# EAGLE design alimrobotmobile (EAGLE 6.3)
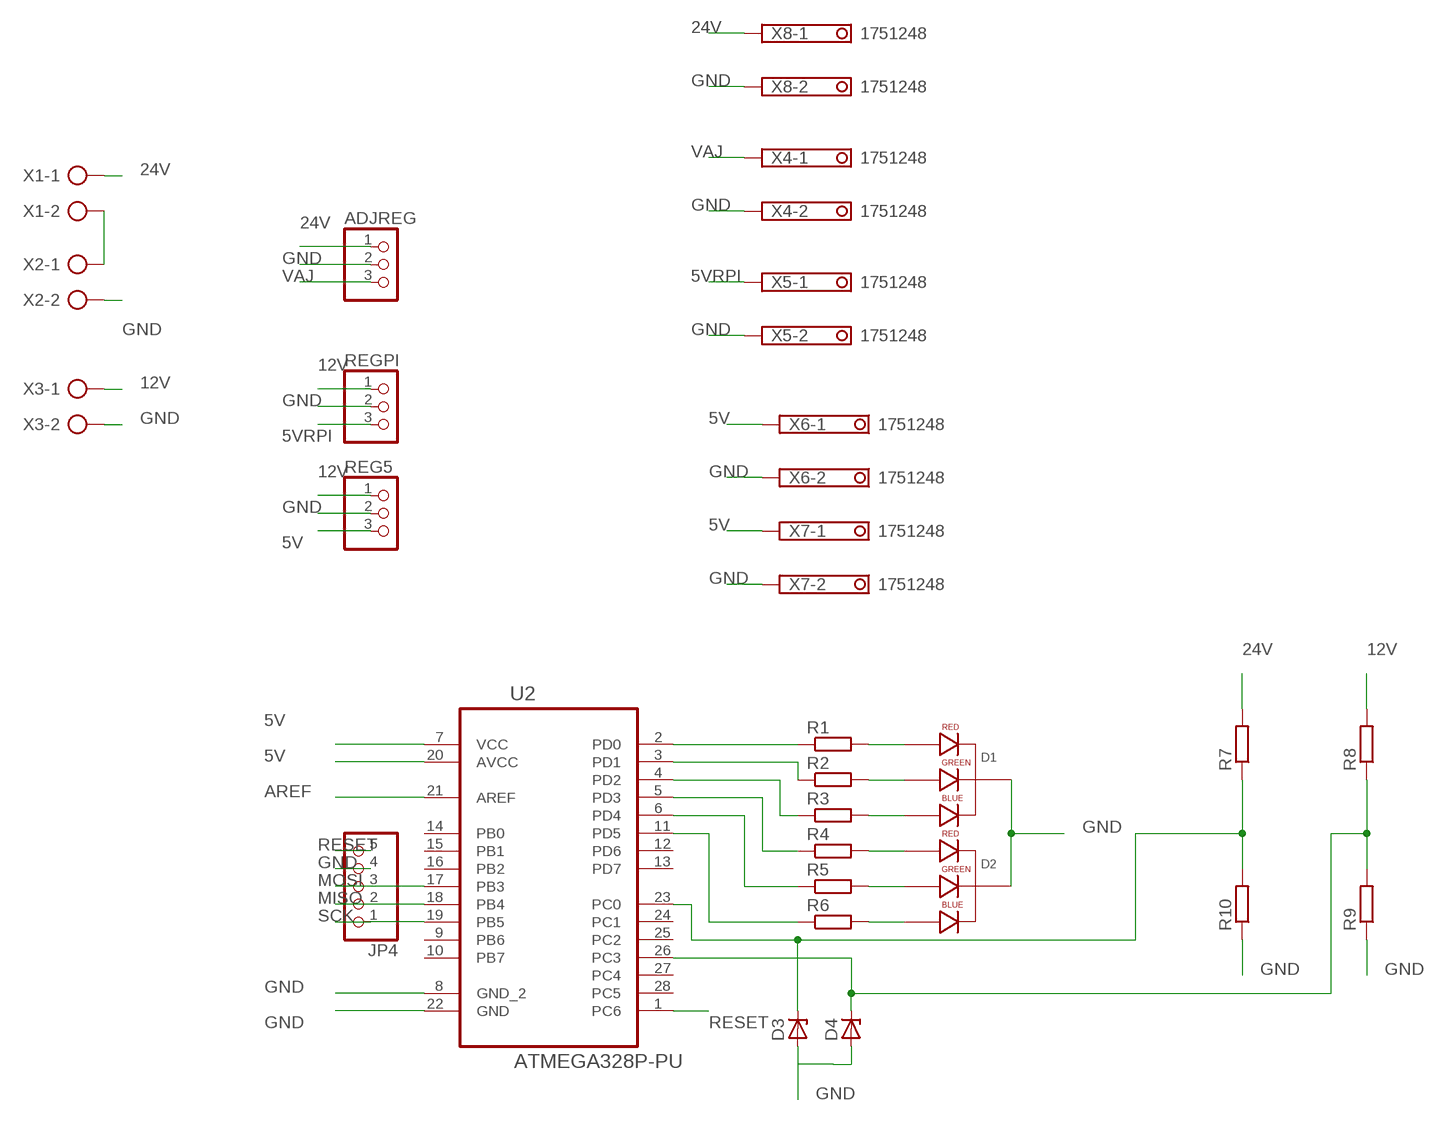
[diagram p0: schematic, sheet 1]

## Parts
ADJREG  PINHD-1X3  [1X03]
D1  LED-RGB-CC-THRUCLEAR  [LED-RGB-THRU]
D2  LED-RGB-CC-THRUCLEAR  [LED-RGB-THRU]
D3  ZENER-DIODEZD-12.5  [ZDIO12.5]
D4  ZENER-DIODEZD-12.5  [ZDIO12.5]
JP4  PINHD-1X5  [1X05]
R1  R-EU_0207/12  [0207/12]
R2  R-EU_0207/12  [0207/12]
R3  R-EU_0207/12  [0207/12]
R4  R-EU_0207/12  [0207/12]
R5  R-EU_0207/12  [0207/12]
R6  R-EU_0207/12  [0207/12]
R7  R-EU_0207/12  [0207/12]
R8  R-EU_0207/12  [0207/12]
R9  R-EU_0207/12  [0207/12]
R10  R-EU_0207/12  [0207/12]
REG5  PINHD-1X3  [1X03]
REGPI  PINHD-1X3  [1X03]
U2  ATMEGA328P-PU  [DIP254P762X457-28]
X1  AK300/2  [AK300/2]
X2  AK300/2  [AK300/2]
X3  AK300/2  [AK300/2]
X4  1751248  [1751248]
X5  1751248  [1751248]
X6  1751248  [1751248]
X7  1751248  [1751248]
X8  1751248  [1751248]

## Nets
5V: REG5.3 U2.7(VCC) U2.20(AVCC) X6.1 X7.1
5VRPI: REGPI.3 X5.1
12V: R8.2 REG5.1 REGPI.1 X3.1
24V: ADJREG.1 R7.2 X1.1 X8.1
AREF: U2.21(AREF)
GND: ADJREG.2 D1.2(CATHODE) D2.2(CATHODE) D3.A D4.A JP4.4 R9.1 R10.1 REG5.2 REGPI.2 U2.8(GND_2) U2.22(GND) X2.2 X3.2 X4.2 X5.2 X6.2 X7.2 X8.2
MISO: JP4.2 U2.18(PB4)
MOSI: JP4.3 U2.17(PB3)
N$2: R1.1 U2.2(PD0)
N$3: R2.1 U2.3(PD1)
N$4: D4.C R8.1 R9.2 U2.26(PC3)
N$5: R3.1 U2.4(PD2)
N$6: R4.1 U2.5(PD3)
N$7: R5.1 U2.6(PD4)
N$8: R6.1 U2.11(PD5)
N$9: D1.1(RED_CATHODE) R1.2
N$10: D1.3(GREEN_CATHODE) R2.2
N$11: X1.2 X2.1
N$12: D1.4(BLUE_CATHODE) R3.2
N$13: D2.1(RED_CATHODE) R4.2
N$14: D2.3(GREEN_CATHODE) R5.2
N$15: D2.4(BLUE_CATHODE) R6.2
N$17: D3.C R7.1 R10.2 U2.23(PC0)
RESET: JP4.5 U2.1(PC6)
SCK: JP4.1 U2.19(PB5)
VAJ: ADJREG.3 X4.1
Unconnected: U2.9(PB6) U2.10(PB7) U2.12(PD6) U2.13(PD7) U2.14(PB0) U2.15(PB1) U2.16(PB2) U2.24(PC1) U2.25(PC2) U2.27(PC4) U2.28(PC5)

## Library data of the parts
ADJREG REG5 REGPI = pinhead:PINHD-1X3: PIN HEADER
D1 D2 = LED-RGB:LED-RGB-CC-THRU: RGB Through-hole common cathode LED SparkFun Storefront: COM-00105 (Clear) COM-09264 (Diffuse); PROD_ID: DIO-08418
D3 D4 = diode:ZENER-DIODE: Z-Diode
JP4 = pinhead:PINHD-1X5: PIN HEADER
R1-R10 = rcl:R-EU_: RESISTOR, European symbol
U2 = Atmel_By_element14_Batch_1-00:ATMEGA328P-PU: 8-bit Microcontroller with In-System Programmable Flash; MPN: ATMEGA328P-PU; OC_FARNELL: 1715487; OC_NEWARK: 15R0268; PACKAGE: PDIP-28; SUPPLIER: Atmel
X1-X3 = con-ptr500:AK300/2: CONNECTOR; OC_FARNELL: unknown; OC_NEWARK: unknown
X4-X8 = con-phoenix-350:1751248: MKDS 1/ 2-3,5 Printklemme Nennstrom: 10 A Bemessungsspannung: 160 V Raster: 3,5 mm Polzahl: 2 Montageart: Löten Anschlussart: Schraubanschluss Anschlussrichtung vom Leiter zur Platine: 0° Source: http://eshop.phoenixcontact.com .. 1751248.pdf; OC_FARNELL: unknown; OC_NEWARK: unknown

## Board
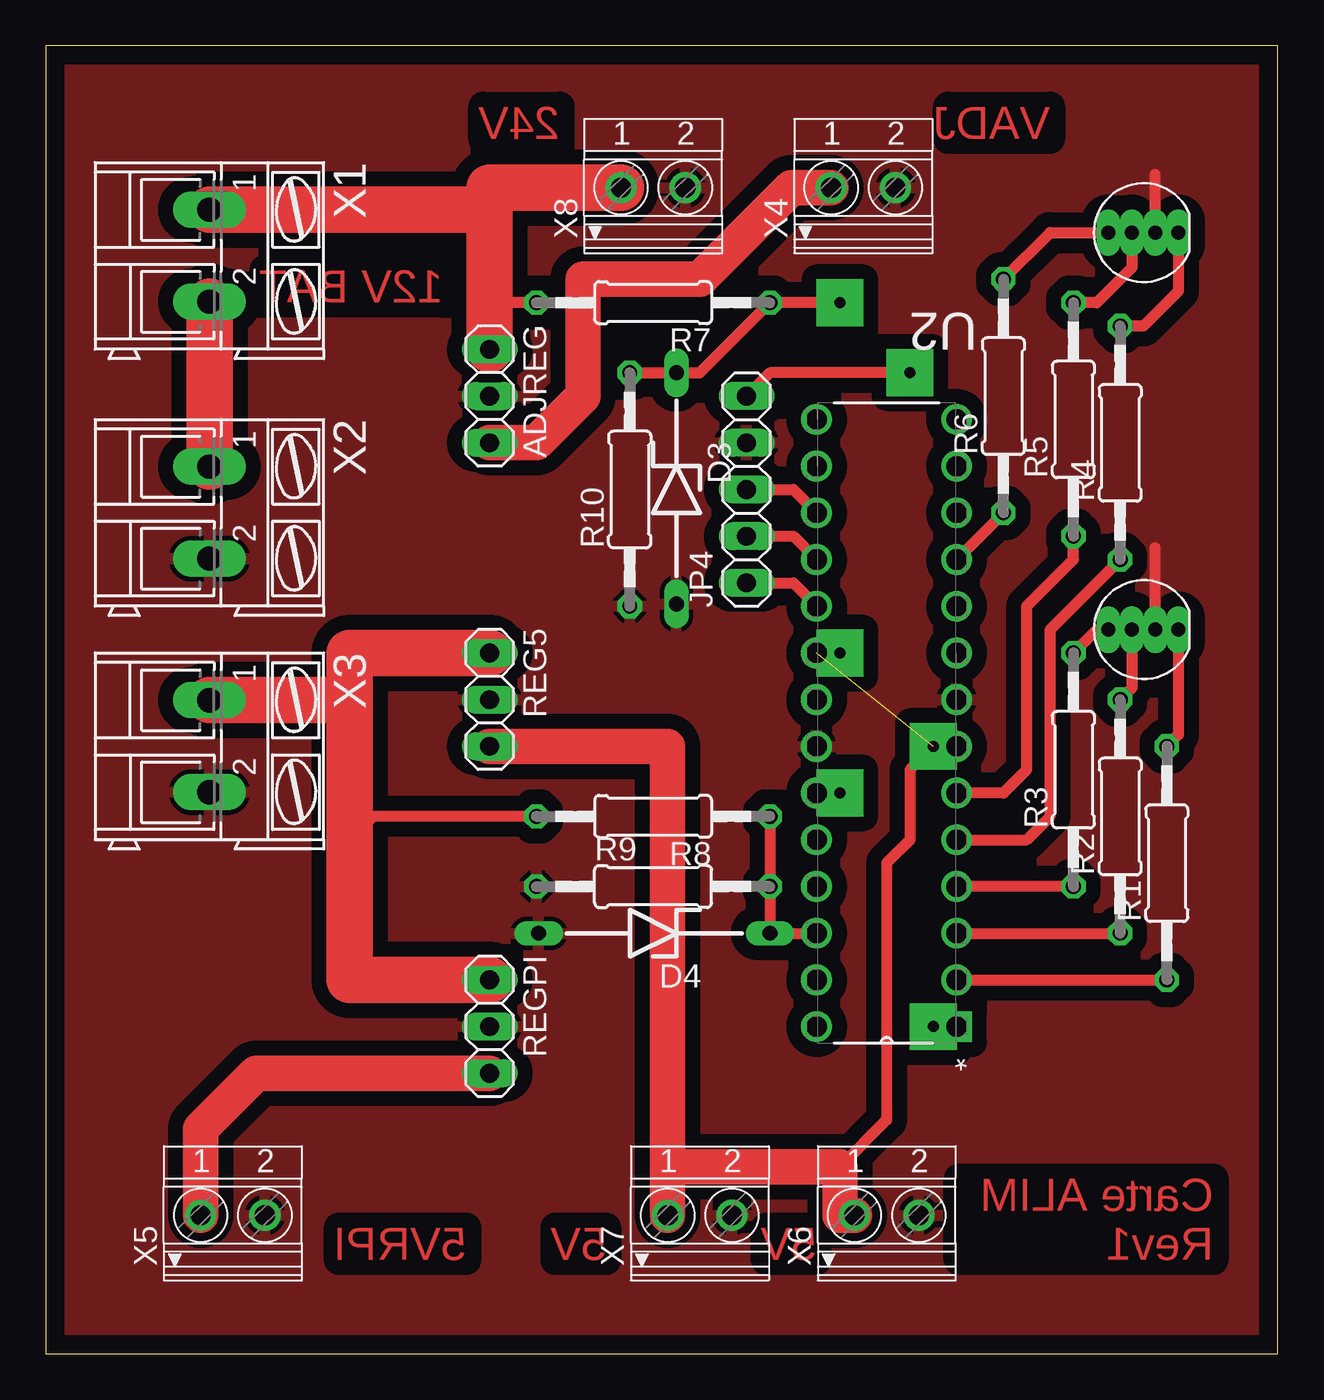
[diagram p1: board, top side]
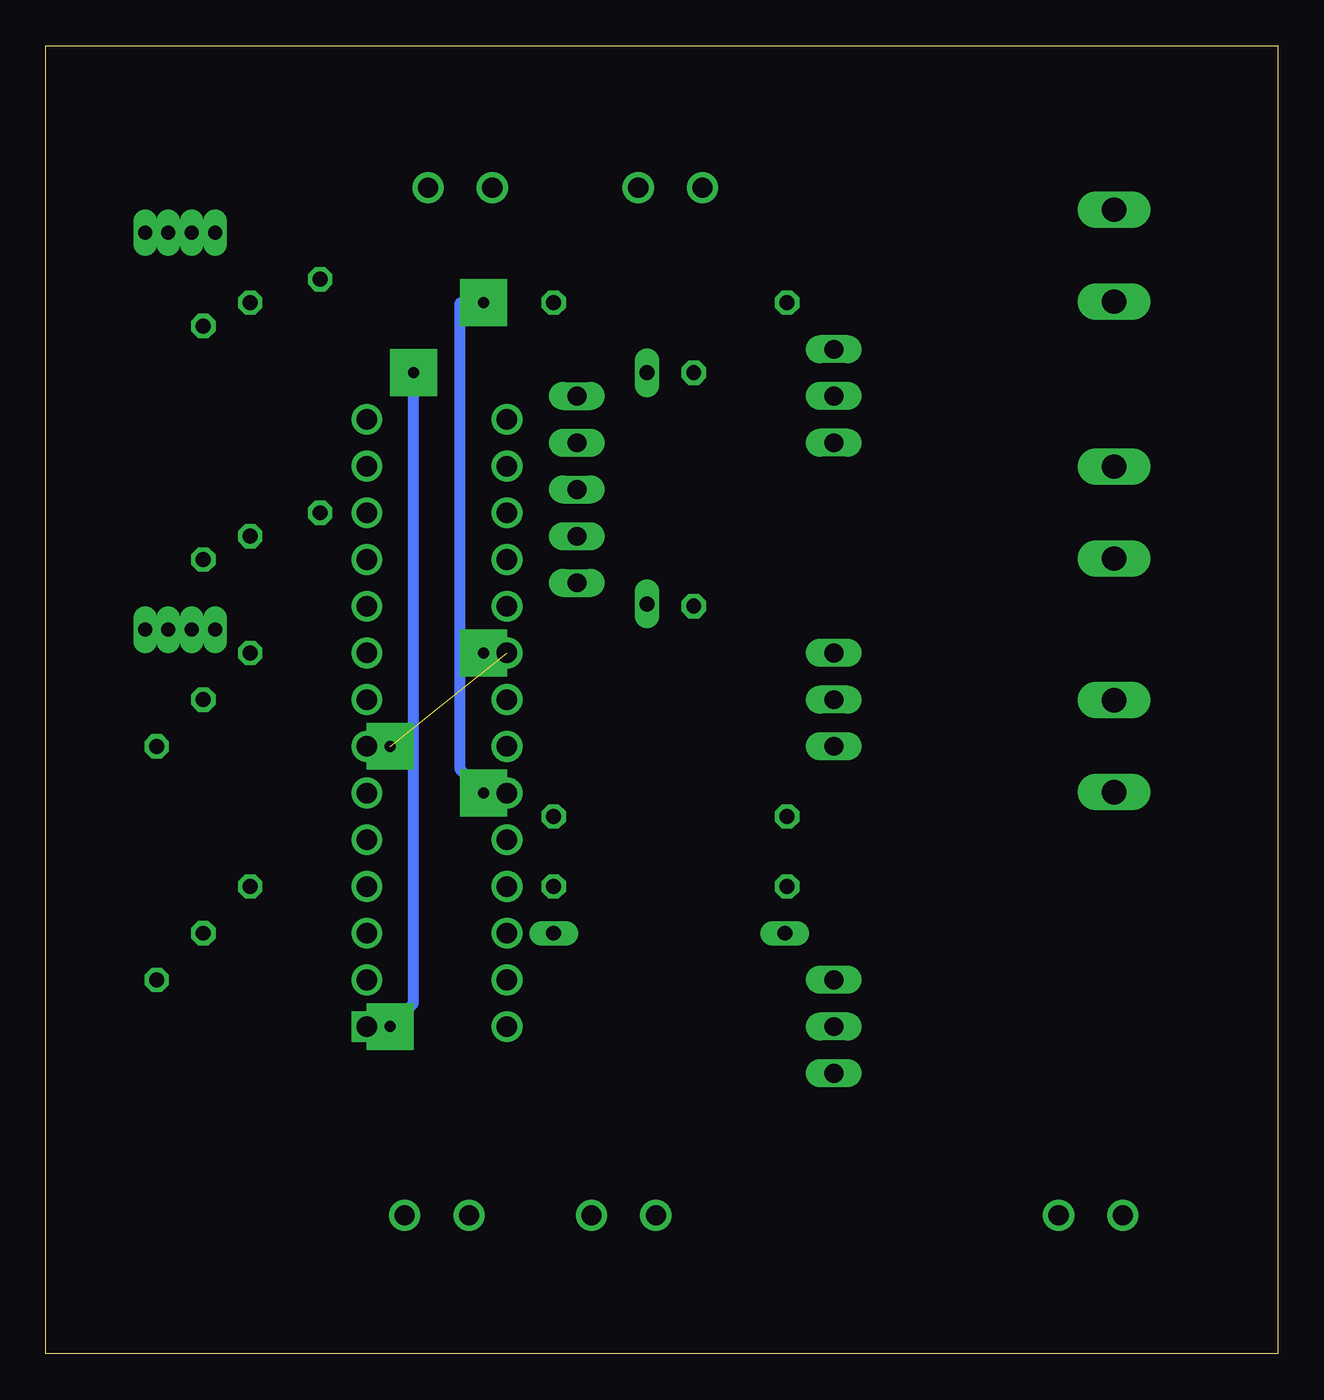
[diagram p2: board, bottom side, seen from below]

Size 66.98 x 71.11 mm. Coordinates in mm from the lower left corner, seen from the top.
Outline: 0,0 66.98,0 66.98,71.11 0,71.11 0,0
Copper layers (1*16): Top 0.035mm / dielectric 1.5mm / Bottom 0.035mm
Design rules "default": minimum track width 10mil, minimum drill 24mil, track to track 8mil, track to pad 8mil, pad to pad 8mil, via to via 8mil, smd to smd 8mil, copper to edge 40mil, drill to drill 8mil, minimum pad ring 10mil, minimum via ring 8mil, stop-mask expansion 4mil, vias tented up to drill 0mil, thermal gap 10mil

### Footprints (pad centres in the part's own frame; a part is rotated, then mirrored left to right if it is on the bottom)
1X03 = drill 1.016 long: 1 -2.54,0; 2 0,0; 3 2.54,0
LED-RGB-THRU = drill 0.762 pad 0.889 long: 1 1.905,0; 2 0.635,0; 3 -0.635,0; 4 -1.905,0
ZDIO12.5 = drill 0.813 long: A 6.223,0; C -6.35,0
1X05 = drill 1.016 long: 1 -5.08,0; 2 -2.54,0; 3 0,0; 4 2.54,0; 5 5.08,0
0207/12 = drill 0.813 octagon: 1 -6.35,0; 2 6.35,0
DIP254P762X457-28 = drill 1.118 square: 1 -7.62,33.02 | drill 1.118: 2 -7.62,30.48; 3 -7.62,27.94; 4 -7.62,25.4; 5 -7.62,22.86; 6 -7.62,20.32; 7 -7.62,17.78; 8 -7.62,15.24; 9 -7.62,12.7; 10 -7.62,10.16; 11 -7.62,7.62; 12 -7.62,5.08; 13 -7.62,2.54; 14 -7.62,0; 15 0,0; 16 0,2.54; 17 0,5.08; 18 0,7.62; 19 0,10.16; 20 0,12.7; 21 0,15.24; 22 0,17.78; 23 0,20.32; 24 0,22.86; 25 0,25.4; 26 0,27.94; 27 0,30.48; 28 0,33.02
AK300/2 = drill 1.321 long: 1 -2.515,0; 2 2.489,0
1751248 = drill 1.1 pad 1.7: 1 -1.75,-0.1; 2 1.75,-0.1

### Placement (x,y rotation side)
ADJREG  24.13,52.07 270 top
D1  59.69,39.37 0 top
D2  59.69,60.96 0 top
D3  34.29,46.99 270 top
D4  33.02,22.86 180 top
JP4  38.1,46.99 90 top
R1  60.96,26.67 90 top
R2  58.42,29.21 90 top
R3  55.88,31.75 90 top
R4  58.42,49.53 90 top
R5  55.88,50.8 90 top
R6  52.07,52.07 90 top
R7  33.02,57.15 180 top
R8  33.02,29.21 180 top
R9  33.02,25.4 0 top
R10  31.75,46.99 90 top
REG5  24.13,35.56 270 top
REGPI  24.13,17.78 270 top
U2  41.91,50.8 180 top
X1  8.89,59.69 270 top
X2  8.89,45.72 270 top
X3  8.89,33.02 270 top
X4  44.45,63.5 0 top
X5  10.16,7.62 0 top
X6  45.72,7.62 0 top
X7  35.56,7.62 0 top
X8  33.02,63.5 0 top

### Tracks (layer width: path | path; a pad name or v marks a point on that pad's centre or on a via)
5V  (1 unrouted)
  Top 0.61: U2.7 48.26,33.02 46.99,31.75 46.99,27.94 45.72,26.67 45.72,12.7 43.18,10.16
  Top 1.93: REG5.3 33.81,33.02 33.81,10.16 | 33.81,10.16 X7.1 | X6.1 43.18,7.52 43.18,10.16 33.81,10.16
5VRPI
  Top 1.93: X5.1 8.41,12.22 11.43,15.24 REGPI.3
12V
  Top 0.61: R8.2 17.78,29.21 16.51,27.94
  Top 2.54: X3.1 16.51,35.53 | 16.51,35.53 16.51,38.1 REG5.1 | REGPI.1 16.51,20.32 16.51,27.94 16.51,35.53
24V
  Top 0.61: R7.2 24.13,57.15
  Top 2.54: X1.1 24.13,62.2 | 24.13,62.2 24.13,57.15 ADJREG.1 | X8.1 24.13,63.4 24.13,62.2
GND
  Top 0.61: D1.2 60.32,43.81 | D2.2 60.32,64.14
  pour Top (isolate 0.813): -1.27,72.39 -1.27,-7.62 69.85,-7.62 69.85,72.39
MISO
  Top 0.61: JP4.2 40.64,44.45 U2.18
MOSI
  Top 0.61: JP4.3 40.64,46.99 U2.17
N$2
  Top 0.61: U2.2 R1.1
N$3
  Top 0.61: U2.3 R2.1
N$4
  Top 0.61: R8.1 R9.2 D4.C U2.26
N$5
  Top 0.61: R3.1 U2.4
N$6
  Top 0.61: U2.5 53.34,27.94 54.61,29.21 54.61,39.37 R4.1
N$7
  Top 0.61: U2.6 52.07,30.48 53.34,31.75 53.34,40.64 55.88,43.18 R5.1
N$8
  Top 0.61: U2.11 R6.1
N$9
  Top 0.61: D1.1 61.59,33.66 R1.2
N$10
  Top 0.61: D1.3 59.05,36.2 R2.2
N$11
  Top 2.54: X1.2 X2.1
N$12
  Top 0.61: R3.2 57.15,39.37 D1.4
N$13
  Top 0.61: D2.1 61.59,57.78 59.69,55.88 R4.2
N$14
  Top 0.61: D2.3 59.05,59.05 57.15,57.15 R5.2
N$15
  Top 0.61: R6.2 54.61,60.96 D2.4
N$17  (via drill 0.6 pad 2.54)
  Top 0.61: R10.2 D3.C 35.56,53.34 R7.1 v43.18,57.15 | U2.23 v43.18,30.48
  Bottom 0.61: v43.18,30.48 44.45,31.75 44.45,57.15 v43.18,57.15
N$24  (via drill 0.6 pad 2.54)
  other vias: 48.26,17.78
N$25  (via drill 0.6 pad 2.54)
  other vias: 43.18,38.1
N$26  (via drill 0.6 pad 2.54)
  other vias: 48.26,33.02
N$27  (via drill 0.6 pad 2.54)
  other vias: 43.18,30.48
RESET  (via drill 0.6 pad 2.54)
  Top 0.61: U2.1 v48.26,17.78 | v46.99,53.34 39.37,53.34 JP4.5
  Bottom 0.61: v48.26,17.78 46.99,19.05 v46.99,53.34
SCK
  Top 0.61: JP4.1 40.64,41.91 U2.19
VAJ
  Top 1.93: ADJREG.3 26.67,49.53 29.21,52.07 29.21,58.42 35.56,58.42 40.54,63.4 X4.1

### Text on the board
Top: 24V | VADJ | 12V BAT | 5VRPI | 5V | 5V | Carte ALIM / Rev1